# EasyEDA Pro project 大疆分电板（xt30 gh1.25 立卧卧式）.epro

# Schematic Schematic1
Board Name: Board1; Create Date: 2024-04-07; Page Name: P1; Project Name: 大疆分电板（can_1.25）; Schematic Name: Schematic1; Update Date: 2024-04-09; Company: 嘉立创EDA; Page Size: A4; Version: V1.0
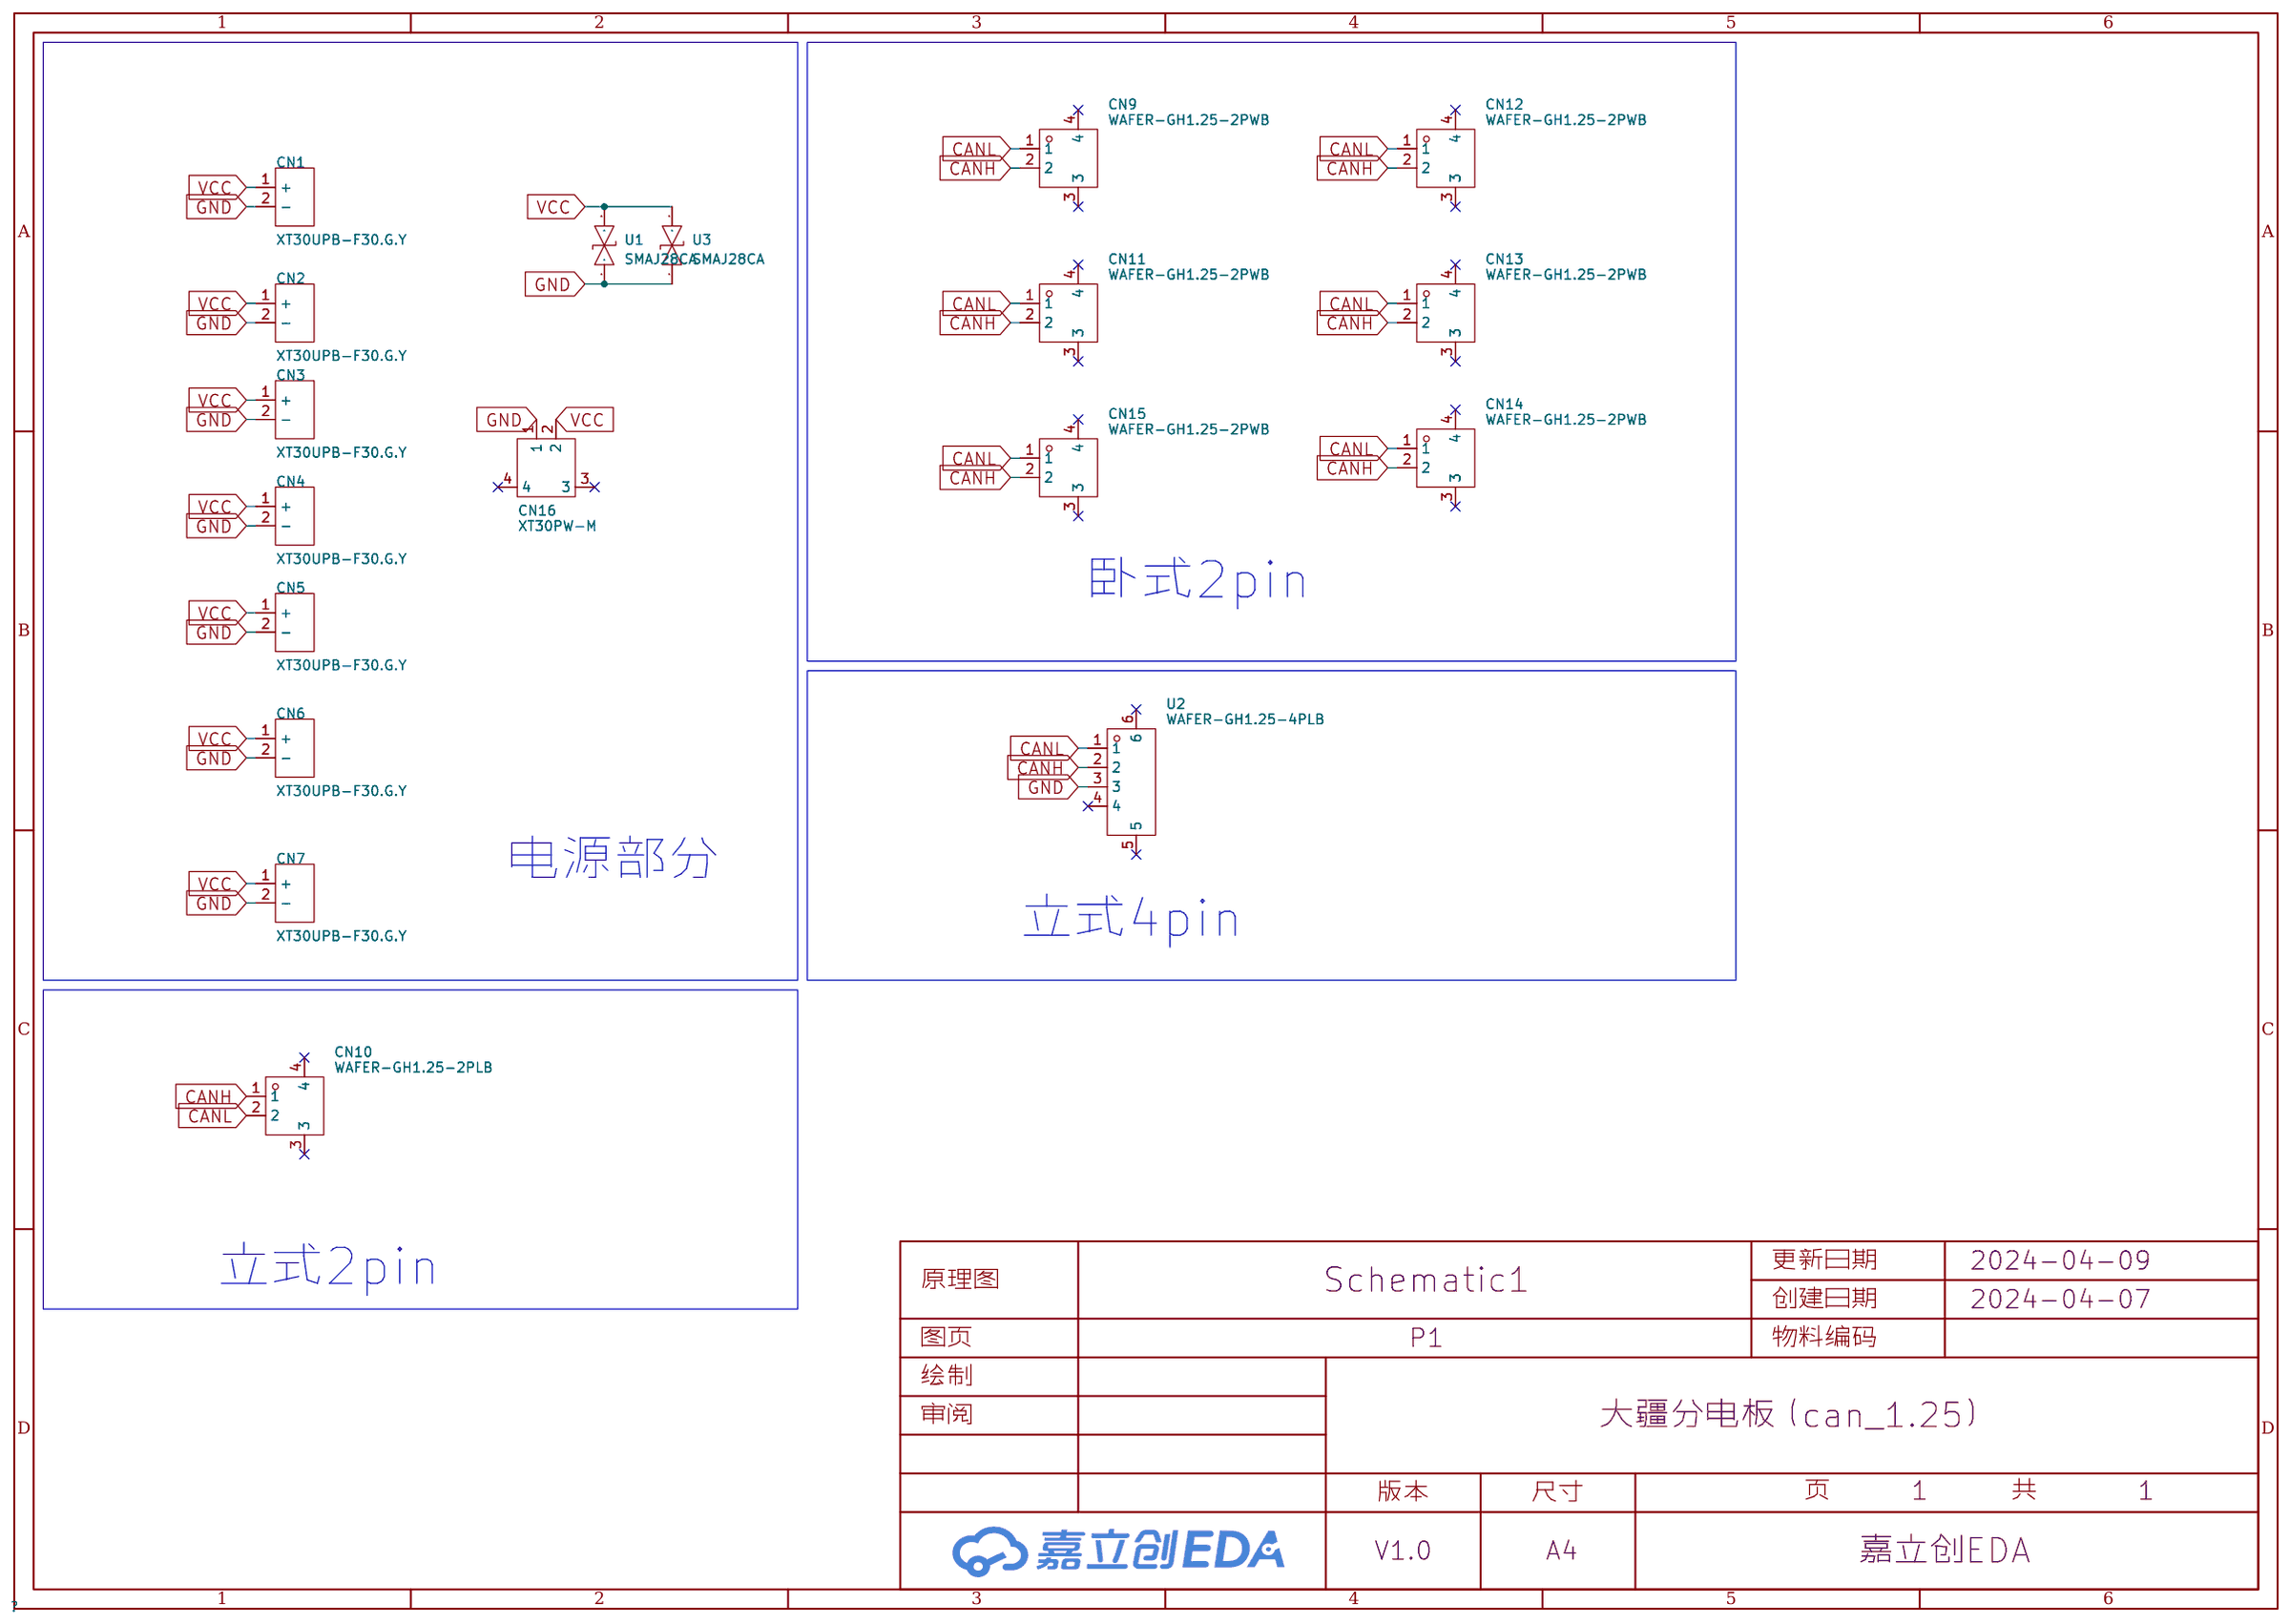
[diagram p0: schematic sheet]

## Parts
CN1  XT30UPB-F30.G.Y  [CONN-TH_XT30UPB-F]
CN2  XT30UPB-F30.G.Y  [CONN-TH_XT30UPB-F]
CN3  XT30UPB-F30.G.Y  [CONN-TH_XT30UPB-F]
CN4  XT30UPB-F30.G.Y  [CONN-TH_XT30UPB-F]
CN5  XT30UPB-F30.G.Y  [CONN-TH_XT30UPB-F]
CN6  XT30UPB-F30.G.Y  [CONN-TH_XT30UPB-F]
CN7  XT30UPB-F30.G.Y  [CONN-TH_XT30UPB-F]
CN9  WAFER-GH1.25-2PWB  [CONN-TH_2P-P1.25_XUNPU_WAFER-GH1.25-2PWB]
CN10  WAFER-GH1.25-2PLB  [CONN-TH_2P-P1.25_XUNPU_WAFER-GH1.25-2PLB]
CN11  WAFER-GH1.25-2PWB  [CONN-TH_2P-P1.25_XUNPU_WAFER-GH1.25-2PWB]
CN12  WAFER-GH1.25-2PWB  [CONN-TH_2P-P1.25_XUNPU_WAFER-GH1.25-2PWB]
CN13  WAFER-GH1.25-2PWB  [CONN-TH_2P-P1.25_XUNPU_WAFER-GH1.25-2PWB]
CN14  WAFER-GH1.25-2PWB  [CONN-TH_2P-P1.25_XUNPU_WAFER-GH1.25-2PWB]
CN15  WAFER-GH1.25-2PWB  [CONN-TH_2P-P1.25_XUNPU_WAFER-GH1.25-2PWB]
CN16  XT30PW-M  [CONN-TH_XT30PW-M]
U1  SMAJ28CA  [SMA_L4.3-W2.7-LS5.0-BI]
U2  WAFER-GH1.25-4PLB  [CONN-SMD_4P-P1.25_XUNPU_WAFER-GH1.25-4PLB]
U3  SMAJ28CA  [SMA_L4.3-W2.7-LS5.0-BI]

## Library data of the parts
CN1-CN7 = XT30UPB-F30.G.Y: 类别:-;类型1:-;; LCSC Part Name: AMASS(艾迈斯)直立焊板式连接器XT30UPB30-F.G.*; Supplier Part: C108769; Manufacturer: AMASS(艾迈斯); JLCPCB Part Class: Extended Part; Datasheet: https://atta.szlcsc.com/upload/public/pdf/source/20220715/AFD68B9E8B6CA95A7295DBF4AF9325E4.pdf; Supplier: LCSC; Brand: 艾迈斯; Type: 航模插头; Colour: 黄色; RatedVoltage: DC 500V; InterfaceType: 母头; MetalMaterial: 镀金; InsulationMaterial: PA; RatedCurrent: 15A; contact resistance: 0.65mΩ
CN9 CN11-CN15 = WAFER-GH1.25-2PWB: 插针结构:1x2P;间距:1.25mm;安装方式:卧贴;参考系列:GH;总PIN数:2P;排数:1;每排PIN数:2;额定电流:1A;工作温度范围:-25℃~+85℃;; LCSC Part Name: 1x2P 间距:1.25mm 卧贴 系列:GH; Supplier Part: C3029377; Manufacturer: XUNPU(讯普); Supplier Footprint: SMD,P=1.25mm,卧贴; JLCPCB Part Class: Extended Part; Datasheet: https://atta.szlcsc.com/upload/public/pdf/source/20220527/CB8773BFB0913C3B8ABD62CB38BA101A.pdf; Supplier: LCSC; Pins Structure: 1x2P; Pitch: 1.25mm; Mounting Style: 卧贴; Reference Series: GH; Number of Pins: 2P; Number of Rows: 1; Number of PINs Per Row: 2; Current Rating (Max): 1A; Operating Temperature Range: -25℃~+85℃
CN10 = WAFER-GH1.25-2PLB: 插针结构:1x2P;间距:1.25mm;安装方式:立贴;参考系列:GH;总PIN数:2P;排数:1;每排PIN数:2;额定电流:1A;工作温度范围:-25℃~+85℃;; LCSC Part Name: 1x2P 间距:1.25mm 立贴 系列:GH; Supplier Part: C3029368; Manufacturer: XUNPU(讯普); Supplier Footprint: SMD,P=1.25mm; JLCPCB Part Class: Extended Part; Datasheet: https://atta.szlcsc.com/upload/public/pdf/source/20220527/44F824AAC8C2B617205E15955FF9C23D.pdf; Supplier: LCSC; Pins Structure: 1x2P; Pitch: 1.25mm; Mounting Style: 立贴; Reference Series: GH; Number of Pins: 2P; Number of Rows: 1; Number of PINs Per Row: 2; Current Rating (Max): 1A; Operating Temperature Range: -25℃~+85℃
CN16 = XT30PW-M: 类别:-;类型1:-;; LCSC Part Name: AMASS(艾迈斯)航模插头 卧式弯脚 XT30PW-M公头; Supplier Part: C431092; Manufacturer: AMASS(艾迈斯); JLCPCB Part Class: 扩展库; Datasheet: https://atta.szlcsc.com/upload/public/pdf/source/20220222/6A9F22F7850E25B33E1BE430ADF8560B.pdf; Supplier: LCSC; Brand: 艾迈斯; Type: 航模插头; RatedVoltage: DC 500V; InterfaceType: 公头; RatedCurrent: 15A; RecommendedWireGauge: 16/18/20AWG; contact resistance: 1.2mΩ; specifications: 2pin
U1 U3 = SMAJ28CA_C908827: 反向截止电压(Vrwm):28V;最大钳位电压:45.4V;峰值脉冲电流(Ipp)@10/1000us:8.8A;击穿电压:31.1V;; LCSC Part Name: 双向TVS 28V截止 8.8A峰值脉冲; Supplier Part: C908827; Manufacturer: GOODWORK(固得沃克); Supplier Footprint: SMA(DO-214AC); JLCPCB Part Class: Extended Part; Datasheet: https://atta.szlcsc.com/upload/public/pdf/source/20201231/C908757_5436EAF671B686EFC2F0DD2098F0ED89.pdf; Supplier: LCSC; Reverse Stand-Off Voltage (Vrwm): 28V; Maximum Clamping Voltage: 45.4V; Peak Pulse Current (Ipp)@10/1000us: 8.8A; Breakdown Voltage: 31.1V; Reverse Leakage Current (Ir): 5uA; Type: TVS
U2 = WAFER-GH1.25-4PLB: 插针结构:1x4P;间距:1.25mm;安装方式:立贴;参考系列:GH;总PIN数:4P;排数:1;每排PIN数:4;额定电流:1A;工作温度范围:-25℃~+85℃;; LCSC Part Name: 1x4P 间距:1.25mm 立贴 系列:GH; Supplier Part: C3029370; Manufacturer: XUNPU(讯普); Supplier Footprint: SMD,P=1.25mm; JLCPCB Part Class: Extended Part; Datasheet: https://atta.szlcsc.com/upload/public/pdf/source/20220527/44F824AAC8C2B617205E15955FF9C23D.pdf; Supplier: LCSC; Pins Structure: 1x4P; Pitch: 1.25mm; Mounting Style: 立贴; Reference Series: GH; Number of Pins: 4P; Number of Rows: 1; Number of PINs Per Row: 4; Current Rating (Max): 1A; Operating Temperature Range: -25℃~+85℃

## Nets
GND: CN1.2(-) CN2.2(-) CN3.2(-) CN4.2(-) CN5.2(-) CN6.2(-) CN7.2(-) CN16.1 U1.1 U2.3 U3.1
VCC: CN1.1(+) CN2.1(+) CN3.1(+) CN4.1(+) CN5.1(+) CN6.1(+) CN7.1(+) CN16.2 U1.2 U3.2
CANH: CN9.2 CN10.1 CN11.2 CN12.2 CN13.2 CN14.2 CN15.2 U2.2
CANL: CN9.1 CN10.2 CN11.1 CN12.1 CN13.1 CN14.1 CN15.1 U2.1

Not connected (* = marked no-connect by the designer): CN9 3* 4*; CN10 3* 4*; CN11 3* 4*; CN12 3* 4*; CN13 3* 4*; CN14 3* 4*; CN15 3* 4*; CN16 3* 4*; U2 4* 5* 6*

## Notes on the sheet
- 卧式2pin
- 电源部分
- 立式4pin
- 立式2pin

# Board PCB1
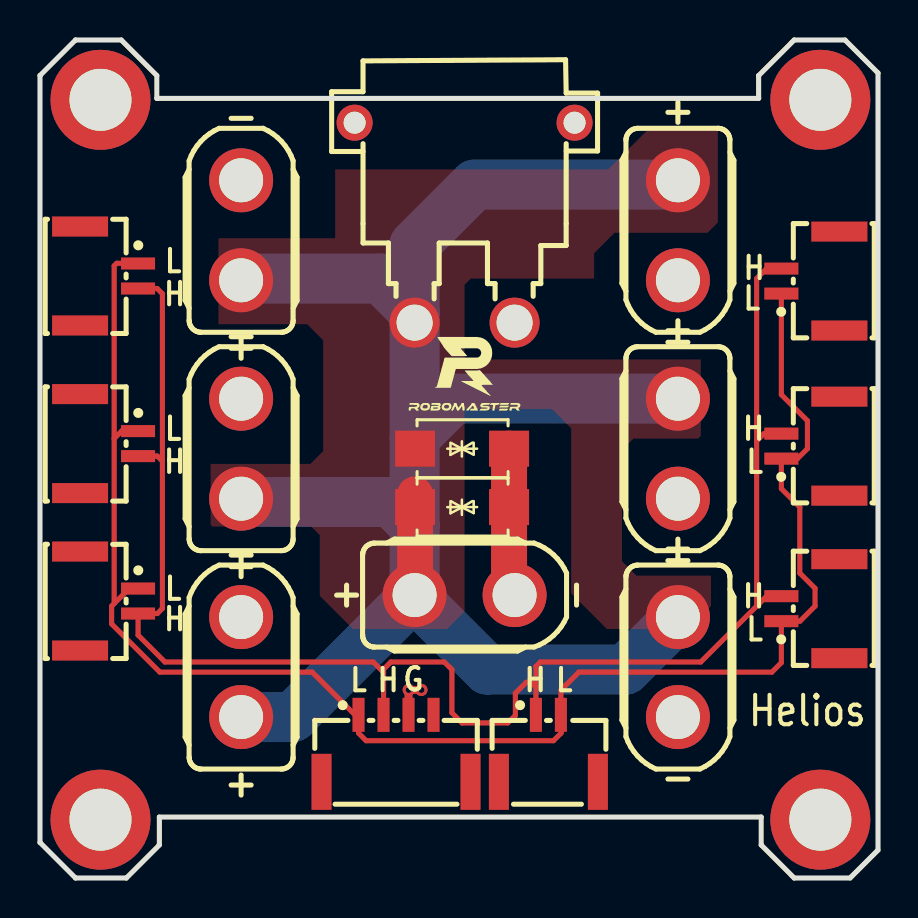
[diagram p1: board, top side]
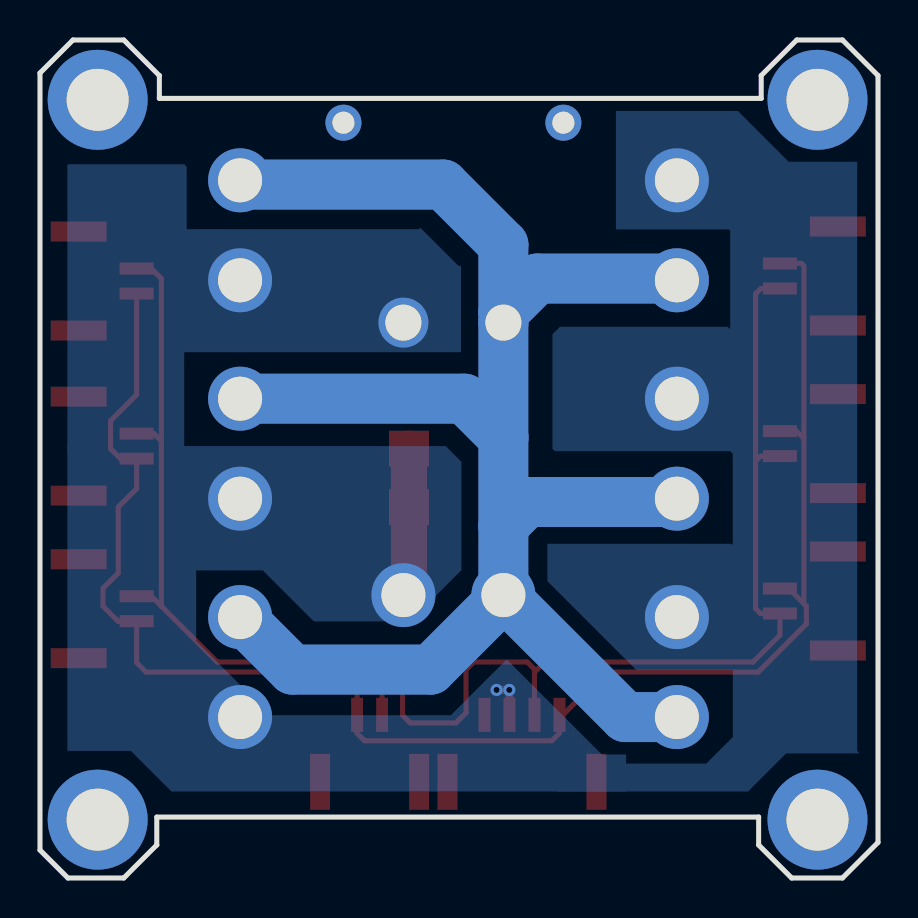
[diagram p2: board, bottom side, seen from below]

Outline 41.91 x 41.91 mm; copper layers: Top Layer, Bottom Layer. Coordinates in mm from the lower left corner of the outline.
Outline path: 0,40.13 1.78,41.91 4.06,41.91 5.84,40.13 5.84,38.99 35.94,38.99 35.94,40.13 37.72,41.91 40.26,41.91 41.91,40.26 41.91,1.4 40.51,0 37.72,0 36.07,1.65 36.07,3.05 5.97,3.05 5.97,1.65 4.32,0 1.78,0 0,1.78 0,40.13
Stack: Top Layer 0.035mm / Dielectric1 1.51mm FR4 er 4.5 / Bottom Layer 0.035mm

## Design rules (mm)
net CANH: DP1
net CANL: DP1
template: JLCPCB Capability(Two Layers Board)
spacing copperThickness1oz (default): track to track 0.102, other pairs 0.152 to 0.3
spacing copperThickness2oz: track to track 0.203, other pairs 0.152 to 0.3
track width copperThickness1oz (default): min 0.127, default 0.254, max 2.54
track width copperThickness2oz: min 0.203, default 0.254, max 2.54
differential pair differentialPair (default): width min 0.127, default 0.254, max 2.54; gap min 0.152, default 0.152
via viaSize (default): diameter min 0.5, default 0.61, max 10; hole min 0.3, default 0.305, max 6.3

## Placement (name value [footprint] x y rotation side)
CN1  XT30UPB-F30.G.Y  [CONN-TH_XT30UPB-F]  10.06 32.39 90 top
CN2  XT30UPB-F30.G.Y  [CONN-TH_XT30UPB-F]  10.06 21.47 90 top
CN3  XT30UPB-F30.G.Y  [CONN-TH_XT30UPB-F]  10.06 10.55 90 top
CN4  XT30UPB-F30.G.Y  [CONN-TH_XT30UPB-F]  31.9 32.39 270 top
CN5  XT30UPB-F30.G.Y  [CONN-TH_XT30UPB-F]  31.9 21.47 270 top
CN6  XT30UPB-F30.G.Y  [CONN-TH_XT30UPB-F]  31.9 10.55 270 top
CN7  XT30UPB-F30.G.Y  [CONN-TH_XT30UPB-F]  21.24 14.15 0 top
CN9  WAFER-GH1.25-2PWB  [CONN-TH_2P-P1.25_XUNPU_WAFER-GH1.25-2PWB]  38.53 29.85 90 top
CN10  WAFER-GH1.25-2PLB  [CONN-TH_2P-P1.25_XUNPU_WAFER-GH1.25-2PLB]  25.43 6.48 0 top
CN11  WAFER-GH1.25-2PWB  [CONN-TH_2P-P1.25_XUNPU_WAFER-GH1.25-2PWB]  3.45 30.11 270 top
CN12  WAFER-GH1.25-2PWB  [CONN-TH_2P-P1.25_XUNPU_WAFER-GH1.25-2PWB]  38.53 21.6 90 top
CN13  WAFER-GH1.25-2PWB  [CONN-TH_2P-P1.25_XUNPU_WAFER-GH1.25-2PWB]  38.53 13.47 90 top
CN14  WAFER-GH1.25-2PWB  [CONN-TH_2P-P1.25_XUNPU_WAFER-GH1.25-2PWB]  3.45 13.85 270 top
CN15  WAFER-GH1.25-2PWB  [CONN-TH_2P-P1.25_XUNPU_WAFER-GH1.25-2PWB]  3.45 21.72 270 top
CN16  XT30PW-M  [CONN-TH_XT30PW-M]  21.24 32.77 180 top
NOREF  -  [Pad_e34]  39.03 38.92 0 top
NOREF#2  -  [Pad_e35]  3.03 2.92 0 top
NOREF#3  -  [Pad_e31]  3.03 38.92 0 top
NOREF#4  -  [Pad_e36]  39.03 2.92 0 top
U1  SMAJ28CA  [SMA_L4.3-W2.7-LS5.0-BI]  21.11 18.55 180 top
U2  WAFER-GH1.25-4PLB  [CONN-SMD_4P-P1.25_XUNPU_WAFER-GH1.25-4PLB]  17.81 6.48 0 top
U3  SMAJ28CA  [SMA_L4.3-W2.7-LS5.0-BI]  21.11 21.47 180 top

## Footprints (pads in the part's own frame, mm; a bottom-side part is the same pattern mirrored in y, then rotated)
CONN-SMD_4P-P1.25_XUNPU_WAFER-GH1.25-4PLB
  rect 0.6x1.7 smd: 1(-1.875,1.675) 2(-0.625,1.675) 3(0.625,1.675) 4(1.875,1.675)
  rect 1x2.8 smd: 5(-3.725,-1.675) 6(3.725,-1.675)
CONN-TH_2P-P1.25_XUNPU_WAFER-GH1.25-2PLB
  rect 0.6x1.7 smd: 1(-0.625,1.675) 2(0.625,1.675)
  rect 1x2.8 smd: 3(2.475,-1.675) 4(-2.475,-1.675)
CONN-TH_2P-P1.25_XUNPU_WAFER-GH1.25-2PWB
  rect 0.6x1.7 smd: 1(-0.625,1.45) 2(0.625,1.45)
  rect 1x2.8 smd: 3(-2.475,-1.45) 4(2.475,-1.45)
CONN-TH_XT30PW-M
  round 2.5 hole 1.8: 1(-2.5,5) 2(2.5,5)
  round 1.8 hole 1.1: 3(5.5,-5) 4(-5.5,-5)
CONN-TH_XT30UPB-F
  round 3.2 hole 2.2: 1(-2.5,0) 2(2.5,0)
Pad_e31
  round 5 hole 3.1: 7(0,0)
Pad_e34
  round 5 hole 3.1: 7(0,0)
Pad_e35
  round 5 hole 3.1: 7(0,0)
Pad_e36
  round 5 hole 3.1: 7(0,0)
SMA_L4.3-W2.7-LS5.0-BI
  rect 2x1.8 smd: 1(-2.35,0) 2(2.35,0)

## Nets
As in the schematic.

Pads without a net: CN9 3 4; CN10 3 4; CN11 3 4; CN12 3 4; CN13 3 4; CN14 3 4; CN15 3 4; CN16 3 4; NOREF 7; NOREF#2 7; NOREF#3 7; NOREF#4 7; U2 4 5 6

## Via types
v1: diameter 0.61, hole 0.305, Top Layer to Bottom Layer, 2 vias

## Routing (per net, layer and track width the routed paths; a pad name or vN(x,y) marks a point on that pad's centre or on a via; arc(x,y) is an arc through that point)
GND: length 9.3
  Top Layer w0.4: U2.3 18.43,9.4 v1(18.44,9.41) v1(19.08,9.41)
  Top Layer w1.8: U3.1 U1.1 23.46,14.43 CN7.2
VCC: length 96.7
  Top Layer w1.8: CN7.1 18.76,14.17 18.76,19.18
  Bottom Layer w2.5: CN6.1 29.28,10.42 22.38,10.42 18.74,14.06 CN7.1 ; 18.74,22.02 20.69,23.97 CN5.1 ; 18.74,22.02 18.74,17.62 ; 18.74,22.02 18.74,28.29 ; CN7.1 18.74,17.62 ; CN7.1 12.64,8.05 CN3.1 ; 18.74,17.62 17.55,18.8 10.23,18.8 CN2.1 ; 18.74,28.29 18.74,31.67 21.74,34.68 31.69,34.68 CN4.1 ; 18.74,28.29 17.04,29.98 10.15,29.98 CN1.1
CANH: length 83.4
  Top Layer w0.254: 35.84,13.6 33.05,10.8 25.02,10.8 24.8,10.58 24.8,9.54 ; 35.84,13.6 35.84,21.85 ; 35.84,13.6 36.34,14.09 CN13.2 ; CN11.2 5.86,29.48 6.12,29.22 6.12,20.85 ; CN15.2 5.87,21.1 6.12,20.85 ; 24.8,9.54 CN10.1 ; 24.8,9.54 24.55,9.79 24.32,9.79 23.78,9.24 23.78,8.14 23.39,7.75 21.11,7.75 20.6,8.26 20.6,10.42 20.22,10.8 17.55,10.8 17.18,10.44 17.18,10.28 ; 6.12,20.85 6.12,13.48 5.87,13.23 CN14.2 4.91,12.15 6.25,10.8 16.66,10.8 17.18,10.28 ; 35.84,21.85 36.21,22.22 CN12.2 ; 35.84,21.85 35.84,29.98 36.34,30.48 CN9.2 ; 17.18,10.28 U2.2
CANL: length 83.4
  Top Layer w0.254: CN15.1 4.89,22.36 4.09,22.36 3.71,21.98 ; 3.71,13.72 3.58,13.6 3.58,12.71 6,10.29 13.62,10.29 15.75,8.16 U2.1 15.93,7.25 16.31,6.87 25.68,6.87 26.06,7.25 26.06,8.15 CN10.2 26.05,9.4 26.95,10.29 36.6,10.29 37.08,10.77 CN13.1 38.01,12.84 38.76,13.6 38.76,14.49 38,15.25 38,18.55 37.08,19.47 CN12.1 37.88,20.97 38.38,21.47 38.38,22.87 37.08,24.17 CN9.1 ; 3.71,13.72 3.71,21.98 ; 3.71,13.72 4.47,14.49 4.89,14.49 CN14.1 ; CN11.1 4.89,30.74 3.84,30.74 3.71,30.61 3.71,21.98

## Copper pours and planes (outline as drawn; the poured copper is in the pictures)
GND on Bottom Layer: 0.92,38.36 16.53,38.36 16.53,4.33 0.92,4.33
GND on Bottom Layer: 12.6,21.72 40.54,21.72 40.54,4.33 12.6,4.33
GND on Bottom Layer: 20.85,35.69 40.54,35.69 40.54,21.09 20.85,21.09
VCC on Top Layer: 18.74,25.93 33.55,25.93 33.55,12.45 18.74,12.45
VCC on Top Layer: 8.53,37.49 33.99,37.49 33.99,12.45 8.53,12.45

## Text on the board
Top Silkscreen Layer: H | L | G | Helios
